# EasyEDA Pro project ProDoc_Rev1.21_2024-06-05.epro

# Schematic WCH-LinkE
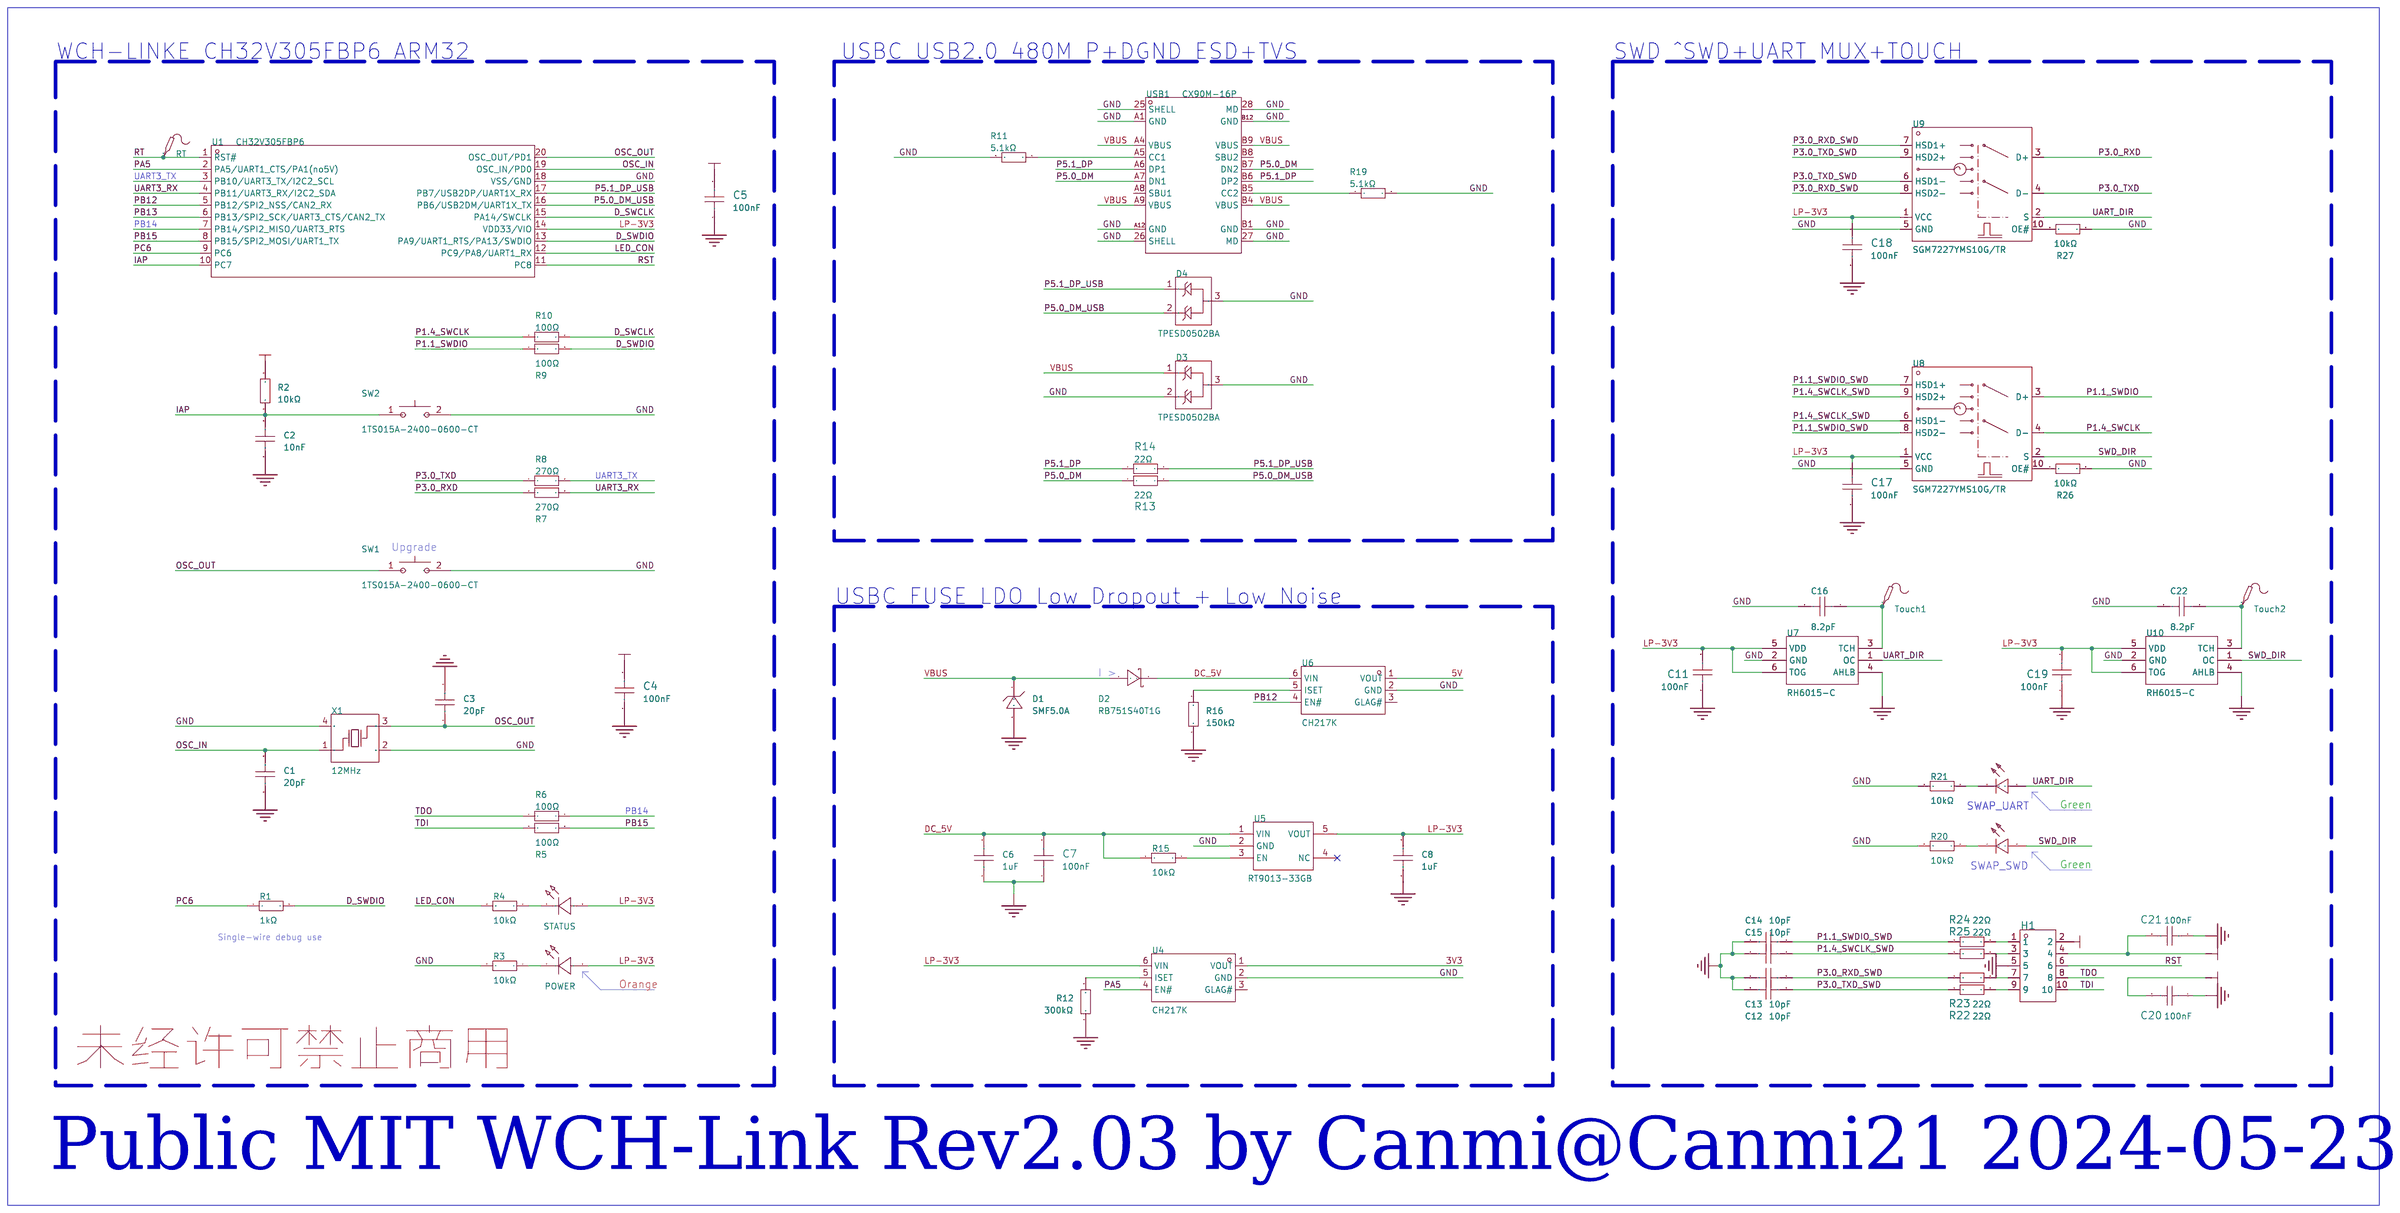
[diagram p0: schematic sheet]

## Parts
C1  20pF  [C0402]
C2  10nF  [C0402]
C3  20pF  [C0402]
C4  100nF  [C0402]
C5  100nF  [C0402]
C6  1uF  [C0402]
C7  100nF  [C0402]
C8  1uF  [C0402]
C11  100nF  [C0402]
C12  10pF  [C0402]
C13  10pF  [C0402]
C14  10pF  [C0402]
C15  10pF  [C0402]
C16  8.2pF  [C0402]
C17  100nF  [C0402]
C18  100nF  [C0402]
C19  100nF  [C0402]
C20  100nF  [C0402]
C21  100nF  [C0402]
C22  8.2pF  [C0402]
D1  SMF5.0A  [SOD-123FL_L2.8-W1.7-LS3.6-RD]
D2  RB751S40T1G  [SOD-523_L1.2-W0.8-LS1.6-RD]
D3  TPESD0502BA  [SOT-523_L1.6-W0.8-P1.00-LS1.6-BR]
D4  TPESD0502BA  [SOT-523_L1.6-W0.8-P1.00-LS1.6-BR]
H1  X6521WV-2x05H-C60D30  [HDR-TH_10P-P2.54-V-M-R2-C5-S2.54]
R1  1kΩ  [R0402]
R2  10kΩ  [R0402]
R3  10kΩ  [R0402]
R4  10kΩ  [R0402]
R5  100Ω  [R0402]
R6  100Ω  [R0402]
R7  270Ω  [R0402]
R8  270Ω  [R0402]
R9  100Ω  [R0402]
R10  100Ω  [R0402]
R11  5.1kΩ  [R0402]
R12  300kΩ  [R0402]
R13  22Ω  [R0402]
R14  22Ω  [R0402]
R15  10kΩ  [R0402]
R16  150kΩ  [R0402]
R19  5.1kΩ  [R0402]
R20  10kΩ  [R0402]
R21  10kΩ  [R0402]
R22  22Ω  [R0402]
R23  22Ω  [R0402]
R24  22Ω  [R0402]
R25  22Ω  [R0402]
R26  10kΩ  [R0402]
R27  10kΩ  [R0402]
RT  -  [Test-Point-0.5mm]
SW1  1TS015A-2400-0600-CT  [SW-SMD_L3.0-W2.0-LS3.5]
SW2  1TS015A-2400-0600-CT  [SW-SMD_L3.0-W2.0-LS3.5]
SWAP_SWD  NCD0603R1  [LED0603-RD_RED]
SWAP_UART  NCD0603R1  [LED0603-RD_RED]
Touch1  -  [Test-Point-0.5mm]
Touch2  -  [Test-Point-0.5mm]
U1  CH32V305FBP6  [TSSOP-20_L6.5-W4.4-P0.65-LS6.4-BL]
U2  POWER  [LED0402-RD_ORANGE]
U3  STATUS  [LED0402-RD_BLUE]
U4  CH217K  [SOT-23-6_L2.9-W1.6-P0.95-LS2.8-BL]
U5  RT9013-33GB  [SOT-23-5_L3.0-W1.7-P0.95-LS2.8-BL]
U6  CH217K  [SOT-23-6_L2.9-W1.6-P0.95-LS2.8-BL]
U7  RH6015-C  [SOT-23-6_L2.9-W1.6-P0.95-LS2.8-BR]
U8  SGM7227YMS10G/TR  [MSOP-10_L3.0-W3.0-P0.50-LS5.0-BL]
U9  SGM7227YMS10G/TR  [MSOP-10_L3.0-W3.0-P0.50-LS5.0-BL]
U10  RH6015-C  [SOT-23-6_L2.9-W1.6-P0.95-LS2.8-BR]
USB1  CX90M-16P  [USB-C-SMD_CX90M-16P]
X1  12MHz  [OSC-SMD_4P-L3.2-W2.5-BL]

## Library data of the parts
C1 C3 = GRM1555C1H200JA01D: LCSC Part Name: 20pF ±5% 50V; Supplier Part: C76959; Manufacturer: muRata(村田); Supplier Footprint: 0402; Datasheet: https://atta.szlcsc.com/upload/public/pdf/source/20180307/C76959_15204091273971407747.pdf; Supplier: LCSC; Tolerance: ±5%; Voltage Rated: 50V; Temperature Coefficient: C0G
C2 = GCM155R71H103KA55D: 容值:10nF;精度:±10%;额定电压:50V;材质(温度系数):X7R;; LCSC Part Name: 10nF ±10% 50V; Supplier Part: C91601; Manufacturer: muRata(村田); Supplier Footprint: 0402; Datasheet: https://atta.szlcsc.com/upload/public/pdf/source/20161226/1482720174418.pdf; Supplier: LCSC; Tolerance: ±10%; Voltage Rated: 50V; Temperature Coefficient: X7R
C4 C5 C7 C11 C17-C21 = GRM155R71H104KE14D: 容值:100nF;精度:±10%;额定电压:50V;材质(温度系数):X7R;; LCSC Part Name: 100nF ±10% 50V; Supplier Part: C77020; Manufacturer: muRata(村田); Supplier Footprint: 0402; Datasheet: https://atta.szlcsc.com/upload/public/pdf/source/20180326/C77020_39BD49C951FF1AF0DB1F1FAC5AC1E401.pdf; Supplier: LCSC; Tolerance: ±10%; Voltage Rated: 50V; Temperature Coefficient: X7R
C6 C8 = GRM155Z71A105KE01D: 容值:1uF;精度:±10%;额定电压:10V;材质(温度系数):X7R;; LCSC Part Name: 1uF ±10% 10V; Supplier Part: C528974; Manufacturer: muRata(村田); Supplier Footprint: 0402; Datasheet: https://atta.szlcsc.com/upload/public/pdf/source/20200508/C528974_15BC5D9F0CC13FAE313D74FE55DE6D9B.pdf; Supplier: LCSC; Tolerance: ±10%; Voltage Rated: 10V; Temperature Coefficient: X7R
C12-C15 = GRM1555C1H100FA01D: 容值:10pF;精度:±1%;额定电压:50V;材质(温度系数):C0G;; LCSC Part Name: 10pF ±1% 50V; Supplier Part: C161520; Manufacturer: muRata(村田); Supplier Footprint: 0402; Datasheet: https://atta.szlcsc.com/upload/public/pdf/source/20180403/C161520_9A02104BF56AEB009FBC9B33A38C7A93.pdf; Supplier: LCSC; Tolerance: ±1%; Voltage Rated: 50V; Temperature Coefficient: C0G
C16 C22 = GJM1555C1H8R2BB01D: 容值:8.2pF;额定电压:50V;材质(温度系数):C0G;; LCSC Part Name: 8.2pF 50V; Supplier Part: C161336; Manufacturer: muRata(村田); Supplier Footprint: 0402; Datasheet: https://atta.szlcsc.com/upload/public/pdf/source/20180122/C161336_15166126268751291267.pdf; Supplier: LCSC; Voltage Rated: 50V; Temperature Coefficient: C0G
D1 = SMF5.0A: 反向截止电压(Vrwm):5V;最大钳位电压:9.2V;峰值脉冲电流(Ipp)@10/1000us:21.7A;峰值脉冲功率(Ppp)@10/1000us:200W;击穿电压:6.4V;; Supplier Part: C2980403; Manufacturer: GOODWORK(固得沃克); Supplier Footprint: SOD-123FL; Datasheet: https://atta.szlcsc.com/upload/public/pdf/source/20220309/7587E0D41D3B50523D05600E630D0EDF.pdf; Supplier: LCSC; Reverse Stand-Off Voltage (Vrwm): 5V; Maximum Clamping Voltage: 9.2V; Peak Pulse Current (Ipp)@10/1000us: 21.7A; Peak Pulse Power Dissipation (Ppp)@10/1000us: 200W; Breakdown Voltage: 6.4V; Reverse Leakage Current (Ir): 400uA; Type: TVS
D2 = RB751S40T1G: 正向压降(Vf):370mV@1mA;直流反向耐压(Vr):40V;平均整流电流(Io):30mA;; LCSC Part Name: 电压:40V 电流:30mA; Supplier Part: C232576; Manufacturer: onsemi(安森美); Supplier Footprint: SOD-523; Datasheet: https://atta.szlcsc.com/upload/public/pdf/source/20221020/34E26E0C51BD8CE98100F866649E6376.pdf; Supplier: LCSC; Forward Voltage (Vf@If): 370mV@1mA; Reverse Voltage (Vr): 40V; Average Rectified Current (Io): 30mA; Reverse Leakage Current (Ir): 500nA@30V
D3 D4 = RCLAMP0502BA: Supplier: LCSC; Supplier Part: C2841441; Manufacturer: TECH PUBLIC(台舟); Supplier Footprint: SOT-523; Datasheet: https://atta.szlcsc.com/upload/public/pdf/source/20210810/116F5AE9154DE784DEF59F22B5B9D70F.pdf
H1 = X6521WV-2x05H-C60D30: 排数:双排;总PIN位数:10P;间距:2.54mm;插针结构:2x5P;行距:2.54mm;安装类型:直插;圆针/方针:方针;额定电流:3A;额定电压:250V;配合针长度:6mm;塑高:2.5mm;端接针长度:3mm;触头材质:黄铜;触头镀层:金;工作温度范围:-40℃~+105℃;焊接温度(最大值):260℃;颜色:黑色;; Supplier: LCSC; Supplier Part: C706895; Manufacturer: XKB Connectivity(中国星坤); LCSC Part Name: 2.54mm 2x5P 直插 方针 镀金足1U; Supplier Footprint: 插件,P=2.54mm; Datasheet: https://atta.szlcsc.com/upload/public/pdf/source/20211009/DE33EBA4104B5B447A7BD8383FBBA145.pdf; Number of Rows: 双排; Number of Pins: 10P; Pitch: 2.54mm; Pin Structure: 2x5P; Row Spacing: 2.54mm; Mounting Type: 直插; Circluar Pins/Square Pins: 方针; Current Rating (Max): 3A; Voltage Rating (Max): 250V; Length of Mating Pin: 6mm; Insulation Height: 2.5mm; Length of End Connection Pin: 3mm; Contact Material: 黄铜; Contact Plating: 金; Operating Temperature Range: -40℃~+105℃; Welding Temperature (Max): 260℃; Color: 黑色
R1 = 0402WGF1001TCE: 电阻类型:厚膜电阻;阻值:1kΩ;精度:±1%;功率:62.5mW;; LCSC Part Name: 1kΩ ±1% 62.5mW; Supplier Part: C11702; Manufacturer: UNI-ROYAL(厚声); Supplier Footprint: 0402; JLCPCB Part Class: 基础库; Datasheet: https://atta.szlcsc.com/upload/public/pdf/source/20200306/C422600_1E6D84923E4A46A82E41ADD87F860B5C.pdf; Supplier: LCSC; Type: 厚膜电阻; Tolerance: ±1%; Power(Watts): 62.5mW; Temperature Coefficient: ±100ppm/℃; Overload Voltage (Max): 50V; Operating Temperature Range: -55℃~+155℃
R2-R4 R15 R20 R21 R26 R27 = 0402WGF1002TCE: 电阻类型:厚膜电阻;阻值:10kΩ;精度:±1%;功率:62.5mW;; LCSC Part Name: 10kΩ ±1% 62.5mW; Supplier Part: C25744; Manufacturer: UNI-ROYAL(厚声); Supplier Footprint: 0402; Datasheet: https://atta.szlcsc.com/upload/public/pdf/source/20200306/C422600_1E6D84923E4A46A82E41ADD87F860B5C.pdf; Supplier: LCSC; Type: 厚膜电阻; Tolerance: ±1%; Power(Watts): 62.5mW; Temperature Coefficient: ±100ppm/℃; Overload Voltage (Max): 50V; Operating Temperature Range: -55℃~+155℃
R5 R6 R9 R10 = 0402WGF1000TCE: 电阻类型:厚膜电阻;阻值:100Ω;精度:±1%;功率:62.5mW;最大工作电压:50V;温度系数:±200ppm/℃;; LCSC Part Name: 100Ω ±1% 62.5mW 厚膜电阻; Supplier Part: C25076; Manufacturer: UNI-ROYAL(厚声); Supplier Footprint: 0402; Datasheet: https://atta.szlcsc.com/upload/public/pdf/source/20200306/C422600_1E6D84923E4A46A82E41ADD87F860B5C.pdf; Supplier: LCSC; Type: 厚膜电阻; Tolerance: ±1%; Power(Watts): 62.5mW; Overload Voltage (Max): 50V; Temperature Coefficient: ±200ppm/℃; Operating Temperature Range: -55℃~+155℃
R7 R8 = 0402WGF2700TCE: LCSC Part Name: 270Ω ±1% 62.5mW 厚膜电阻; Supplier Part: C25099; Manufacturer: UNI-ROYAL(厚声); Supplier Footprint: 0402; Datasheet: https://atta.szlcsc.com/upload/public/pdf/source/20200306/C422600_1E6D84923E4A46A82E41ADD87F860B5C.pdf; Supplier: LCSC; Type: 厚膜电阻; Tolerance: ±1%; Power(Watts): 62.5mW; Overload Voltage (Max): 50V; Temperature Coefficient: ±100ppm/℃; Operating Temperature Range: -55℃~+155℃
R11 R19 = 0402WGF5101TCE: 电阻类型:厚膜电阻;阻值:5.1kΩ;精度:±1%;功率:62.5mW;; LCSC Part Name: 5.1kΩ ±1% 62.5mW; Supplier Part: C25905; Manufacturer: UNI-ROYAL(厚声); Supplier Footprint: 0402; Datasheet: https://atta.szlcsc.com/upload/public/pdf/source/20200306/C422600_1E6D84923E4A46A82E41ADD87F860B5C.pdf; Supplier: LCSC; Type: 厚膜电阻; Tolerance: ±1%; Power(Watts): 62.5mW; Temperature Coefficient: ±100ppm/℃; Overload Voltage (Max): 50V; Operating Temperature Range: -55℃~+155℃
R12 = 0402WGF3003TCE: LCSC Part Name: 300kΩ ±1% 62.5mW 厚膜电阻; Supplier Part: C25774; Manufacturer: UNI-ROYAL(厚声); Supplier Footprint: 0402; Datasheet: https://atta.szlcsc.com/upload/public/pdf/source/20200306/C422600_1E6D84923E4A46A82E41ADD87F860B5C.pdf; Supplier: LCSC; Type: 厚膜电阻; Tolerance: ±1%; Power(Watts): 62.5mW; Overload Voltage (Max): 50V; Temperature Coefficient: ±100ppm/℃; Operating Temperature Range: -55℃~+155℃
R13 R14 R22-R25 = 0402WGF220JTCE: 电阻类型:厚膜电阻;阻值:22Ω;精度:±1%;功率:62.5mW;温度系数:±100ppm/℃;; LCSC Part Name: 厚膜电阻 22Ω ±1% 62.5mW; Supplier Part: C25092; Manufacturer: UNI-ROYAL(厚声); Supplier Footprint: 0402; Datasheet: https://atta.szlcsc.com/upload/public/pdf/source/20200306/C422600_1E6D84923E4A46A82E41ADD87F860B5C.pdf; Supplier: LCSC; Type: 厚膜电阻; Tolerance: ±1%; Power(Watts): 62.5mW; Temperature Coefficient: ±100ppm/℃; Overload Voltage (Max): 50V; Operating Temperature Range: -55℃~+155℃
R16 = 0402WGF1503TCE: LCSC Part Name: 150kΩ ±1% 62.5mW 厚膜电阻; Supplier Part: C25755; Manufacturer: UNI-ROYAL(厚声); Supplier Footprint: 0402; Datasheet: https://atta.szlcsc.com/upload/public/pdf/source/20200306/C422600_1E6D84923E4A46A82E41ADD87F860B5C.pdf; Supplier: LCSC; Type: 厚膜电阻; Tolerance: ±1%; Power(Watts): 62.5mW; Overload Voltage (Max): 50V; Temperature Coefficient: ±100ppm/℃; Operating Temperature Range: -55℃~+155℃
RT Touch1 Touch2 = Test-Point: Test Point 测试点
SW1 SW2 = 1TS015A-2400-0600-CT: 电路结构:单刀单掷;按钮形状:圆形按钮;作用力:240gf;安装方式:立贴;开关长度:3mm;开关宽度:2mm;开关高度:0.6mm;带支架:不带;触点电流:50mA;额定电压(DC):12V;额定功率:0.6W;绝缘电阻:100MΩ;带灯:无;机械寿命:30万次;; LCSC Part Name: 3*2*0.6mm 立贴 轻触开关; Supplier Part: C256107; Manufacturer: HYP(鸿源精密); Supplier Footprint: SMD,2x3mm; Datasheet: https://atta.szlcsc.com/upload/public/pdf/source/20180720/C256107_0F9EAC01972F470881E166AAE1A26131.pdf; Supplier: LCSC; Circuit: 单刀单掷; Actuator Style: 圆形按钮; Operating Force: 240gf; Mounting Style: 立贴; Switch Length: 3mm; Switch Width: 2mm; Switch Height: 0.6mm; Strike Gundam: 不带; Contact Current: 50mA; Voltage Rating (DC): 12V; Power Rating: 0.6W; Insulation Resistance: 100MΩ; Actuator/Cap Color: 黑色; With Lamp: 无; IP Rating: IP68; Pin Style: SMD接片; Mechanical Life: 30万次; Operating Temperature: -40℃~+90℃
SWAP_SWD SWAP_UART = NCD0603R1_C84263: 发光颜色:红灯;; Supplier: LCSC; Manufacturer: 国星光电; Supplier Part: C84263; LCSC Part Name: 红灯 0603红灯   正贴; Supplier Footprint: 0603; Datasheet: https://atta.szlcsc.com/upload/public/pdf/source/20200820/C84263_DABC6A75E58F576973B407FDBA283D60.pdf; Emitted Color: 红灯
U1 = CH32V305FBP6: Supplier Part: C5123443; Manufacturer: WCH(南京沁恒); Supplier Footprint: TSSOP-20-175mil; Datasheet: https://atta.szlcsc.com/upload/public/pdf/source/20240313/31EDFC15C8D78579D84C0F44B78B73CF.pdf; Supplier: LCSC
U2 = XL-1005UOC: 发光颜色:橙色;功率:55mW;正向电流:25mA;主波长:600nm;透镜颜色:无色透明透镜;色温:-;发光角度:120°;载带方式:正贴;工作温度:-30℃~+85℃;; Supplier Part: C965791; Manufacturer: XINGLIGHT(成兴光); Supplier Footprint: 0402; Datasheet: https://atta.szlcsc.com/upload/public/pdf/source/20221102/20343CDAB7C90B2E3EF3073DFAD545BA.pdf; Supplier: LCSC; Emitted Color: 橙色; Power Dissipation: 55mW; Forward Current: 25mA; Dominant Wavelength: 600nm; Peak Wavelength: 610nm; Lens Color: 无色透明透镜; Viewing Angle: 120°; Mounting Sytle: 正贴; Operating Temperature: -30℃~+85℃
U3 = XL-1005BGWC: 发光颜色:冰蓝色;功率:80mW;正向电流:25mA;主波长:-;二极管配置:-;透镜颜色:绿色透镜;色温:-;发光角度:120°;载带方式:正贴;工作温度:-30℃~+85℃;; Supplier Part: C965797; Manufacturer: XINGLIGHT(成兴光); Supplier Footprint: 0402; Datasheet: https://atta.szlcsc.com/upload/public/pdf/source/20240218/448D33B83DECD1CFAD36DE601F7DDA91.pdf; Supplier: LCSC; Emitted Color: 冰蓝色; Power Dissipation: 80mW; Forward Current: 25mA; Lens Color: 绿色透镜; Viewing Angle: 120°; Mounting Sytle: 正贴; Operating Temperature: -30℃~+85℃
U4 U6 = CH217K: Supplier Part: C7462749; Supplier Footprint: SOT-23-6; JLCPCB Part Class: 扩展库; Supplier: LCSC
U5 = RT9013-33GB: 输出类型:固定;最大输入电压:5.5V;输出电压:3.3V;最大输出电流:500mA;电源纹波抑制比(PSRR):50dB@(10kHz);输出极性:正极;; Supplier: LCSC; Manufacturer: RICHTEK(立锜); Supplier Part: C47773; LCSC Part Name: 输入5.5V 输出3.3V 500mA; Supplier Footprint: SOT-23-5; Datasheet: https://atta.szlcsc.com/upload/public/pdf/source/20150504/1457707282459.pdf; Output Type: 固定; Maximum Input Voltage: 5.5V; Output Voltage: 3.3V; MAX Output Current: 500mA; Power Supply Rejection Ratio (PSRR): 50dB@(10kHz); Dropout Voltage: 400mV@(500mA); standby current: 50uA; Operating Temperature: -40℃~+85℃; Output Polarity: 正极; Number of Outputs: 1
U7 U10 = RH6015C: 通道数:1;芯片功能:电容式触 摸感应;是否自锁:否;工作电压:2.3V~5.5V;工作电流:5uA;工作温度:-20℃~85℃;; Supplier Part: C78180; Manufacturer: RONGHE(融和); Supplier Footprint: SOT-23-6; Datasheet: https://atta.szlcsc.com/upload/public/pdf/source/20180817/C78180_E4E9444B91B4959CB61DC2F6C2FF41BB.pdf; Supplier: LCSC; The Channel Number: 1; Chip Function: 电容式触 摸感应; Whether the Lock: 否; Operating Voltage: 2.3V~5.5V; Operating Current: 5uA; Operating Temperature: -20℃~85℃
U8 U9 = SGM7227YMS10G/TR: 开关电路:-;多路复用器/解复用器电路:-;导通电阻（最大值）:-;开关电压（最大值）:-;; Supplier Part: C182085; Manufacturer: SGMICRO(圣邦微); Supplier Footprint: MSOP-10; JLCPCB Part Class: 扩展库; Datasheet: https://atta.szlcsc.com/upload/public/pdf/source/20180224/C182085_15194371532241364116.pdf; Supplier: LCSC
USB1 = CX90M-16P: 连接器类型:Type-C;标准:USB 2.0;公母:母;端口数量:1;触点数量:16P;安装方式:沉板;额定电流 - 电源:-;工作温度范围:-30℃~+85℃;; Supplier: LCSC; Supplier Part: C2889324; Manufacturer: HRS(广濑); LCSC Part Name: Type-C 母 沉板; Supplier Footprint: SMD; Datasheet: https://atta.szlcsc.com/upload/public/pdf/source/20210903/CB0B8C811670E33A26B7CAB41E7D9B06.pdf; Connector Type: Type-C; Standard: USB 2.0; Gender: 母; Number of Ports: 1; Number of Contacts: 16P; Mounting Style: 沉板; Operating Temperature Range: -30℃~+85℃
X1 = X322512MSB4SI: LCSC Part Name: 12MHz ±10ppm 20pF; Supplier Part: C9002; Manufacturer: YXC(扬兴晶振); Supplier Footprint: SMD3225-4P; Datasheet: https://atta.szlcsc.com/upload/public/pdf/source/20240329/19D5F850207469550BEB00D7DFEDBC7A.pdf; Supplier: LCSC; Crystal Type: 贴片晶振; Normal temperature Frequency Tolerance: ±10ppm; External load capacitor: 20pF; Frequency Stability(Full temperature range): ±20ppm; Operating Temperature: -40℃~+85℃

## Nets
3V3: C21.2 H1.4 U4.1(VOUT)
5V: C20.2 H1.2 U6.1(VOUT)
GND: C1.1 C2.1 C3.2 C4.1 C5.1 C6.1 C7.1 C8.1 C11.1 C12.2 C13.2 C14.2 C15.2 C16.2 C17.1 C18.1 C19.1 C20.1 C21.1 C22.2 D1.2 D3.2 D3.3 D4.3 H1.5 R3.2 R11.2 R12.1 R16.1 R19.2 R20.2 R21.2 R26.2 R27.2 SW1.2 SW2.2 U1.18(VSS/GND) U4.2(GND) U5.2(GND) U6.2(GND) U7.2(GND) U7.4(AHLB) U8.5(GND) U9.5(GND) U10.2(GND) U10.4(AHLB) USB1.25(SHELL) USB1.26(SHELL) USB1.27(MD) USB1.28(MD) USB1.A1(GND) USB1.A12(GND) USB1.B1(GND) USB1.B12(GND) X1.2(GND) X1.4(GND)
VBUS: D1.1 D2.2(A) D3.1 USB1.A4(VBUS) USB1.A9(VBUS) USB1.B4(VBUS) USB1.B9(VBUS)
D_SWCLK: R10.2 U1.15(PA14/SWCLK)
D_SWDIO: R1.2 R9.2 U1.13(PA9/UART1_RTS/PA13/SWDIO)
DC_5V: C6.2 C7.2 D2.1(K) R15.2 U5.1(VIN) U6.6(VIN)
IAP: C2.2 R2.2 SW2.1 U1.10(PC7)
LED_CON: R4.2 U1.12(PC9/PA8/UART1_RX)
LP-3V3: C4.2 C5.2 C8.2 C11.2 C17.2 C18.2 C19.2 R2.1 U1.14(VDD33/VIO) U2.2(A) U3.2(A) U4.6(VIN) U5.5(VOUT) U7.5(VDD) U7.6(TOG) U8.1(VCC) U9.1(VCC) U10.5(VDD) U10.6(TOG)
OSC_IN: C1.2 U1.19(OSC_IN/PD0) X1.1(OSC1)
OSC_OUT: C3.1 SW1.1 U1.20(OSC_OUT/PD1) X1.3(OSC2)
P1.1_SWDIO: R9.1 U8.3(D+)
P1.1_SWDIO_SWD: C15.1 R25.1 U8.7(HSD1+) U8.8(HSD2-)
P1.4_SWCLK: R10.1 U8.4(D-)
P1.4_SWCLK_SWD: C14.1 R24.1 U8.6(HSD1-) U8.9(HSD2+)
P3.0_RXD: R7.1 U9.3(D+)
P3.0_RXD_SWD: C13.1 R23.1 U9.7(HSD1+) U9.8(HSD2-)
P3.0_TXD: R8.1 U9.4(D-)
P3.0_TXD_SWD: C12.1 R22.1 U9.6(HSD1-) U9.9(HSD2+)
P5.0_DM: R13.1 USB1.A7(DN1) USB1.B7(DN2)
P5.0_DM_USB: D4.2 R13.2 U1.16(PB6/USB2DM/UART1X_TX)
P5.1_DP: R14.1 USB1.A6(DP1) USB1.B6(DP2)
P5.1_DP_USB: D4.1 R14.2 U1.17(PB7/USB2DP/UART1X_RX)
PA5: U1.2(PA5/UART1_CTS/PA1(no5V)) U4.4(EN#)
PB12: U1.5(PB12/SPI2_NSS/CAN2_RX) U6.4(EN#)
PB13: U1.6(PB13/SPI2_SCK/UART3_CTS/CAN2_TX)
PB14: R6.2 U1.7(PB14/SPI2_MISO/UART3_RTS)
PB15: R5.2 U1.8(PB15/SPI2_MOSI/UART1_TX)
PC6: R1.1 U1.9(PC6)
RST: H1.6 U1.11(PC8)
RT: RT.1 U1.1(RST#)
SWD_DIR: SWAP_SWD.2(A) U8.2(S) U10.1(OC)
TDI: H1.10 R5.1
TDO: H1.8 R6.1
UART3_RX: R7.2 U1.4(PB11/UART3_RX/I2C2_SDA)
UART3_TX: R8.2 U1.3(PB10/UART3_TX/I2C2_SCL)
UART_DIR: SWAP_UART.2(A) U7.1(OC) U9.2(S)
Net-(C16-1): C16.1 Touch1.1 U7.3(TCH)
Net-(C22-1): C22.1 Touch2.1 U10.3(TCH)
Net-(H1-1): H1.1 R25.2
Net-(H1-3): H1.3 R24.2
Net-(H1-7): H1.7 R23.2
Net-(H1-9): H1.9 R22.2
Net-(R3-1): R3.1 U2.1(K)
Net-(R4-1): R4.1 U3.1(K)
Net-(R11-1): R11.1 USB1.A5(CC1)
Net-(R12-2): R12.2 U4.5(ISET)
Net-(R15-1): R15.1 U5.3(EN)
Net-(R16-2): R16.2 U6.5(ISET)
Net-(R19-1): R19.1 USB1.B5(CC2)
Net-(R20-1): R20.1 SWAP_SWD.1(K)
Net-(R21-1): R21.1 SWAP_UART.1(K)
Net-(R26-1): R26.1 U8.10(OE#)
Net-(R27-1): R27.1 U9.10(OE#)

Not connected (* = marked no-connect by the designer): U4 3(GLAG#); U5 4(NC)*; U6 3(GLAG#); USB1 A8(SBU1) B8(SBU2)

## Notes on the sheet
- WCH-LINKE CH32V305FBP6 ARM32
- USBC USB2.0 480M P+DGND ESD+TVS
- SWD ^SWD+UART MUX+TOUCH
- Upgrade
- USBC FUSE LDO Low Dropout + Low Noise
- I >
- Green
- Green
- Single-wire debug use
- Orange
- 未经许可禁止商用
- Public MIT WCH-Link Rev2.03 by Canmi@Canmi21 2024-05-23
